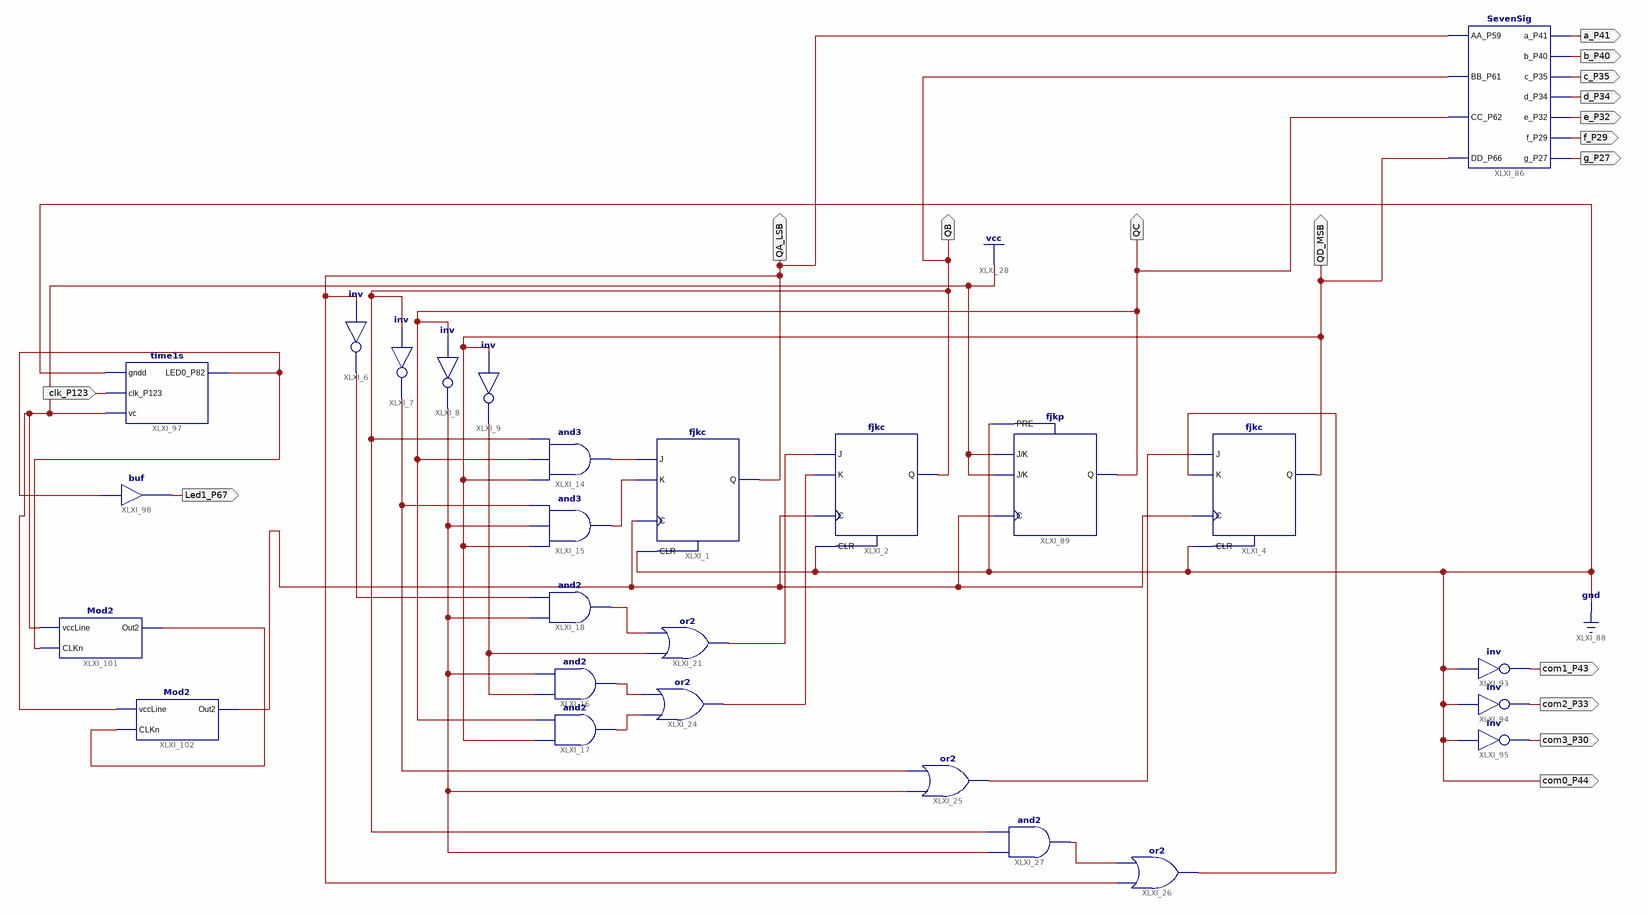
[diagram p0: schematic sheet 1]
// Xilinx ISE schematic Lab8_2_Counter.sch (spartan6) as structural Verilog: 26 symbols, 17 ports
module Lab8_2_Counter (
  input  clk_P123,
  output QA_LSB,
  output QB,
  output QD_MSB,
  output QC,
  output a_P41,
  output b_P40,
  output c_P35,
  output d_P34,
  output e_P32,
  output f_P29,
  output g_P27,
  output com0_P44,
  output com1_P43,
  output com2_P33,
  output com3_P30,
  output Led1_P67
);

  wire PB2_P46, QAinv, QBinv, QCinv, QDinv, XLXN_21, XLXN_26, XLXN_27, XLXN_33, XLXN_34, XLXN_36, XLXN_39,
       XLXN_42, XLXN_44, XLXN_52, XLXN_153, XLXN_154;

  not XLXI_6 (QAinv, QA_LSB);
  not XLXI_7 (QBinv, QB);
  not XLXI_8 (QCinv, QC);
  not XLXI_9 (QDinv, QD_MSB);
  fjkc XLXI_1 (.C(PB2_P46), .CLR(1'b0), .J(XLXN_21), .K(XLXN_52), .Q(QA_LSB));
  and XLXI_14 (XLXN_21, QD_MSB, QC, QB);
  and XLXI_15 (XLXN_52, QD_MSB, QCinv, QBinv);
  and XLXI_18 (XLXN_26, QCinv, QAinv);
  or XLXI_21 (XLXN_27, QDinv, XLXN_26);
  and XLXI_16 (XLXN_33, QDinv, QCinv);
  and XLXI_17 (XLXN_34, QD_MSB, QC);
  or XLXI_24 (XLXN_36, XLXN_34, XLXN_33);
  fjkc XLXI_2 (.C(PB2_P46), .CLR(1'b0), .J(XLXN_27), .K(XLXN_36), .Q(QB));
  or XLXI_25 (XLXN_39, QCinv, QBinv);
  fjkc XLXI_4 (.C(PB2_P46), .CLR(1'b0), .J(XLXN_39), .K(XLXN_44), .Q(QD_MSB));
  and XLXI_27 (XLXN_42, QCinv, QB);
  or XLXI_26 (XLXN_44, QA_LSB, XLXN_42);
  SevenSig XLXI_86 (
    .AA_P59(QA_LSB), .BB_P61(QB), .CC_P62(QC), .DD_P66(QD_MSB), .a_P41(a_P41), .b_P40(b_P40), .c_P35(c_P35),
    .d_P34(d_P34), .e_P32(e_P32), .f_P29(f_P29), .g_P27(g_P27));
  fjkp XLXI_89 (.C(PB2_P46), .J(1'b1), .K(1'b1), .PRE(1'b0), .Q(QC));
  not XLXI_93 (com1_P43, 1'b0);
  not XLXI_94 (com2_P33, 1'b0);
  not XLXI_95 (com3_P30, 1'b0);
  time1s XLXI_97 (.gndd(1'b0), .clk_P123(clk_P123), .vc(1'b1), .LED0_P82(XLXN_153));
  buf XLXI_98 (Led1_P67, XLXN_153);
  Mod2 XLXI_101 (.vccLine(1'b1), .CLKn(XLXN_153), .Out2(XLXN_154));
  Mod2 XLXI_102 (.vccLine(1'b1), .CLKn(XLXN_154), .Out2(PB2_P46));

  assign com0_P44 = 1'b0;
endmodule
